# Altium schematic sheet drv.SchDoc
size A4
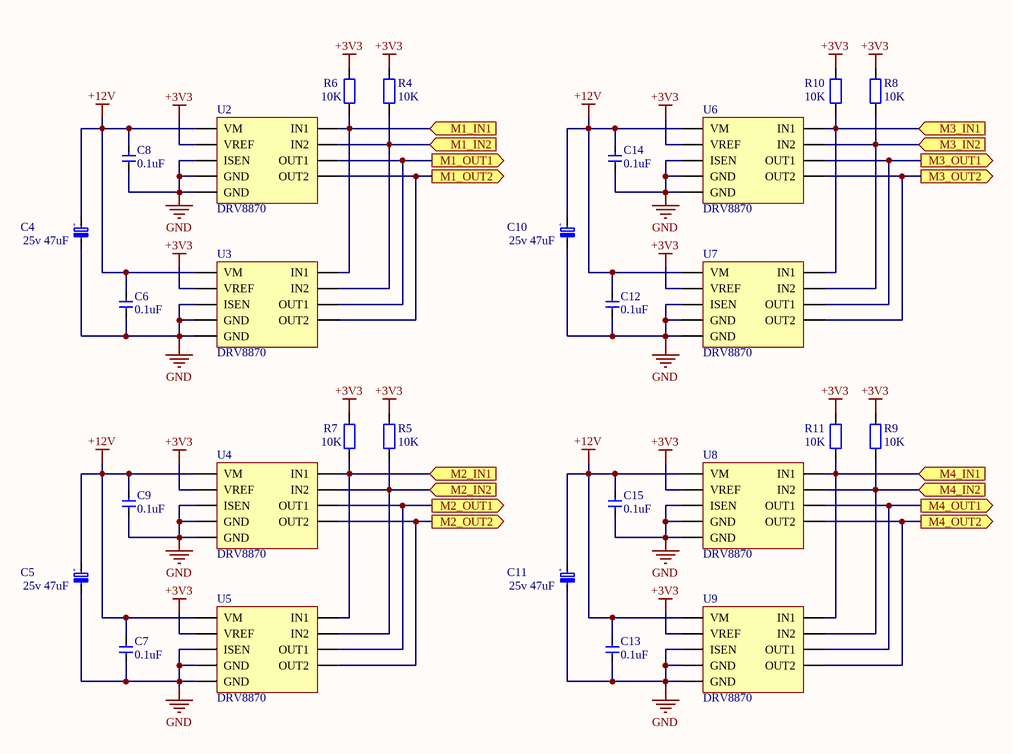
[diagram p0: drv.SchDoc]

## Parts
C4  25v 47uF  [CAP_TANT_D]
C5  25v 47uF  [CAP_TANT_D]
C6  0.1uF  [CAP0805]
C7  0.1uF  [CAP0805]
C8  0.1uF  [CAP0805]
C9  0.1uF  [CAP0805]
C10  25v 47uF  [CAP_TANT_D]
C11  25v 47uF  [CAP_TANT_D]
C12  0.1uF  [CAP0805]
C13  0.1uF  [CAP0805]
C14  0.1uF  [CAP0805]
C15  0.1uF  [CAP0805]
R4  10K  [RES0805]
R5  10K  [RES0805]
R6  10K  [RES0805]
R7  10K  [RES0805]
R8  10K  [RES0805]
R9  10K  [RES0805]
R10  10K  [RES0805]
R11  10K  [RES0805]
U2  DRV8870  [DRV8870]
U3  DRV8870  [DRV8870]
U4  DRV8870  [DRV8870]
U5  DRV8870  [DRV8870]
U6  DRV8870  [DRV8870]
U7  DRV8870  [DRV8870]
U8  DRV8870  [DRV8870]
U9  DRV8870  [DRV8870]

## Ports
M1_IN1 (in), M1_IN2 (in), M1_OUT1 (out), M1_OUT2 (out), M2_IN1 (in), M2_IN2 (in), M2_OUT1 (out), M2_OUT2 (out), M3_IN1 (in), M3_IN2 (in), M3_OUT1 (out), M3_OUT2 (out), M4_IN1 (in), M4_IN2 (in), M4_OUT1 (out), M4_OUT2 (out)

## Nets
+3V3: R4.2 R5.2 R6.2 R7.2 R8.2 R9.2 R10.2 R11.2 U2.4(VREF) U3.4(VREF) U4.4(VREF) U5.4(VREF) U6.4(VREF) U7.4(VREF) U8.4(VREF) U9.4(VREF)
+12V: C4.2(PLUS) C5.2(PLUS) C6.2 C7.2 C8.2 C9.2 C10.2(PLUS) C11.2(PLUS) C12.2 C13.2 C14.2 C15.2 U2.5(VM) U3.5(VM) U4.5(VM) U5.5(VM) U6.5(VM) U7.5(VM) U8.5(VM) U9.5(VM)
GND: C4.1(MINUS) C5.1(MINUS) C6.1 C7.1 C8.1 C9.1 C10.1(MINUS) C11.1(MINUS) C12.1 C13.1 C14.1 C15.1 U2.1(GND) U2.7(ISEN) U2.9(GND) U3.1(GND) U3.7(ISEN) U3.9(GND) U4.1(GND) U4.7(ISEN) U4.9(GND) U5.1(GND) U5.7(ISEN) U5.9(GND) U6.1(GND) U6.7(ISEN) U6.9(GND) U7.1(GND) U7.7(ISEN) U7.9(GND) U8.1(GND) U8.7(ISEN) U8.9(GND) U9.1(GND) U9.7(ISEN) U9.9(GND)
M1_IN1: R6.1 U2.3(IN1) U3.3(IN1) ; port M1_IN1
M1_IN2: R4.1 U2.2(IN2) U3.2(IN2) ; port M1_IN2
M1_OUT1: U2.6(OUT1) U3.6(OUT1) ; port M1_OUT1
M1_OUT2: U2.8(OUT2) U3.8(OUT2) ; port M1_OUT2
M2_IN1: R7.1 U4.3(IN1) U5.3(IN1) ; port M2_IN1
M2_IN2: R5.1 U4.2(IN2) U5.2(IN2) ; port M2_IN2
M2_OUT1: U4.6(OUT1) U5.6(OUT1) ; port M2_OUT1
M2_OUT2: U4.8(OUT2) U5.8(OUT2) ; port M2_OUT2
M3_IN1: R10.1 U6.3(IN1) U7.3(IN1) ; port M3_IN1
M3_IN2: R8.1 U6.2(IN2) U7.2(IN2) ; port M3_IN2
M3_OUT1: U6.6(OUT1) U7.6(OUT1) ; port M3_OUT1
M3_OUT2: U6.8(OUT2) U7.8(OUT2) ; port M3_OUT2
M4_IN1: R11.1 U8.3(IN1) U9.3(IN1) ; port M4_IN1
M4_IN2: R9.1 U8.2(IN2) U9.2(IN2) ; port M4_IN2
M4_OUT1: U8.6(OUT1) U9.6(OUT1) ; port M4_OUT1
M4_OUT2: U8.8(OUT2) U9.8(OUT2) ; port M4_OUT2

## Notes on the sheet
- (in symbol CAP Tantal) +

## Library data of the parts
C4 C5 C10 C11 = CAP Tantal: Tantal SMD Cap
C6-C9 C12-C15 = CAP Ceramic: Ceramic SMD Cap
R4-R11 = RES: RES smd
U2-U9 = DRV8870: DC motor driver 3.6A